# EAGLE design st_ekg_v1 (EAGLE 8.3.1)
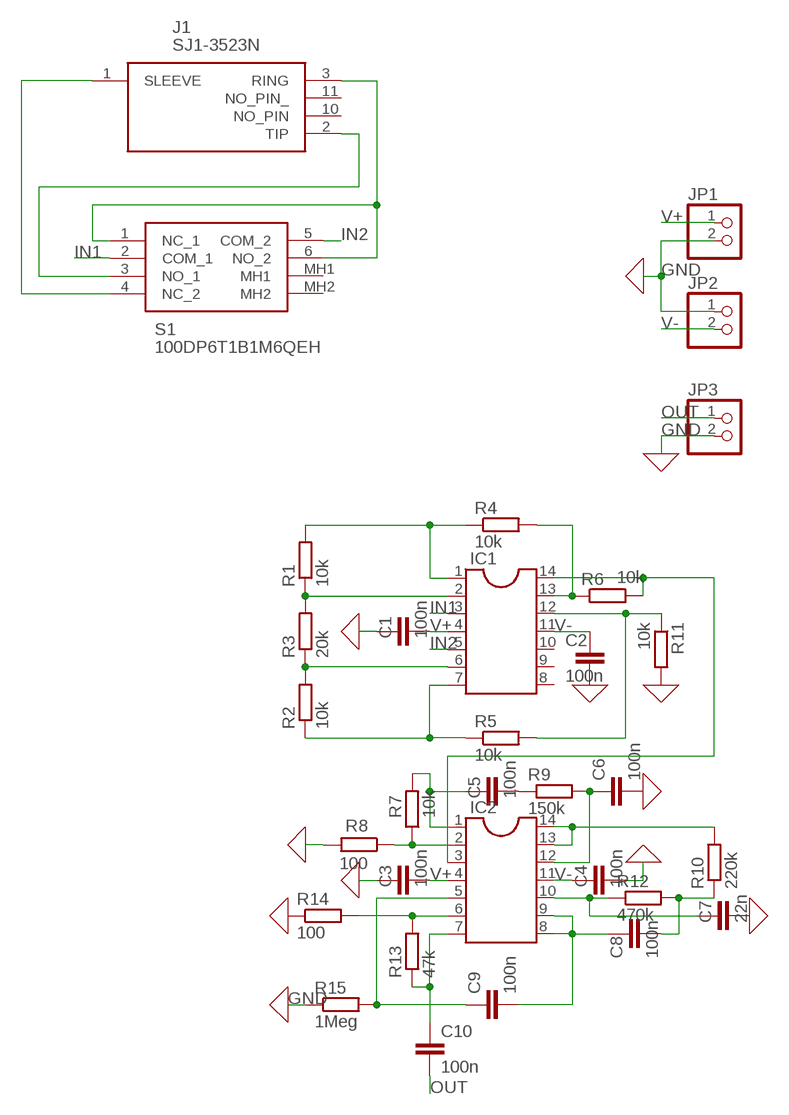
[diagram p0: schematic, sheet 1]

## Parts
C1  100n  C-EUC0805  [C0805]
C2  100n  C-EUC0805  [C0805]
C3  100n  C-EUC0805  [C0805]
C4  100n  C-EUC0805  [C0805]
C5  100n  C-EUC0805  [C0805]
C6  100n  C-EUC0805  [C0805]
C7  22n  C-EUC0805  [C0805]
C8  100n  C-EUC0805  [C0805]
C9  100n  C-EUC0805  [C0805]
C10  100n  C-EUC0805  [C0805]
IC1  DIL14S  [SOCKET-14]
IC2  DIL14S  [SOCKET-14]
J1  SJ1-3523N  [SJ13523N]
JP1  PINHD-1X2  [1X02]
JP2  PINHD-1X2  [1X02]
JP3  PINHD-1X2  [1X02]
R1  10k  R-EU_M0805  [M0805]
R2  10k  R-EU_M0805  [M0805]
R3  20k  R-EU_M0805  [M0805]
R4  10k  R-EU_M0805  [M0805]
R5  10k  R-EU_M0805  [M0805]
R6  10k  R-EU_M0805  [M0805]
R7  10k  R-EU_M0805  [M0805]
R8  100  R-EU_M0805  [M0805]
R9  150k  R-EU_M0805  [M0805]
R10  220k  R-EU_M0805  [M0805]
R11  10k  R-EU_M0805  [M0805]
R12  470k  R-EU_M0805  [M0805]
R13  47k  R-EU_M0805  [M0805]
R14  100  R-EU_M0805  [M0805]
R15  1Meg  R-EU_M0805  [M0805]
S1  100DP6T1B1M6QEH  [100DP6T1B1M6QEH]

## Nets
GND: C1.1 C2.2 C3.1 C4.2 C6.2 C7.2 JP1.2 JP2.1 JP3.2 R8.2 R11.2 R14.1 R15.1
IN1: IC1.3 S1.2(COM_1)
IN2: IC1.5 S1.5(COM_2)
N$1: J1.2(TIP) S1.3(NO_1)
N$2: J1.3(RING) S1.1(NC_1) S1.6(NO_2)
N$3: J1.1(SLEEVE) S1.4(NC_2)
N$4: IC1.2 R1.1 R3.2
N$5: IC1.13 R4.2 R6.1
N$6: IC1.6 R2.2 R3.1
N$7: IC1.12 R5.2 R11.1
N$8: IC1.1 R1.2 R4.1
N$9: IC1.7 R2.1 R5.1
N$10: IC1.14 IC2.3 R6.2
N$12: IC2.2 R7.1 R8.1
N$13: C5.1 IC2.1 R7.2
N$14: C5.2 R9.1
N$15: C6.1 IC2.12 R9.2
N$16: C8.2 R10.1 R12.2
N$17: IC2.13 IC2.14 R10.2
N$18: C7.1 IC2.10 R12.1
N$19: C8.1 C9.2 IC2.8 IC2.9
N$22: C9.1 IC2.5 R15.2
N$23: IC2.6 R13.2 R14.2
N$24: C10.1 IC2.7 R13.1
OUT: C10.2 JP3.1
V+: C1.2 C3.2 IC1.4 IC2.4 JP1.1
V-: C2.1 C4.1 IC1.11 IC2.11 JP2.2
Unconnected: IC1.8 IC1.9 IC1.10 J1.10(NO_PIN) J1.11(NO_PIN_) S1.MH1 S1.MH2

## Library data of the parts
C1-C10 = rcl:C-EU: CAPACITOR, European symbol; SPICEPREFIX: C
IC1 IC2 = ic-package:DIL14: Dual In Line / Socket
J1 = SJ1-3523N:SJ1-3523N: Phone Connectors 3.5 MM AUDIO JACK Source: Datasheet <https://componentsearchengine.com/Datasheets/1/SJ1-3523N.pdf>; DESCRIPTION: Phone Connectors 3.5 MM AUDIO JACK; HEIGHT: 5.5mm; MANUFACTURER_NAME: Same Sky; MANUFACTURER_PART_NUMBER: SJ1-3523N; MOUSER_PART_NUMBER: 490-SJ1-3523N; MOUSER_PRICE-STOCK: https://www.mouser.co.uk/ProductDetail/CUI-Devices/SJ1-3523N?qs=WyjlAZoYn50aNl0vAhb3Tg%3D%3D
JP1-JP3 = pinhead:PINHD-1X2: PIN HEADER
R1-R15 = rcl:R-EU_: RESISTOR, European symbol; SPICEPREFIX: R
S1 = 100DP6T1B1M6QEH:100DP6T1B1M6QEH: TOGGLE, 5A, 120VAC/28VDC DPDT, On-On-On Panel Mount, Right Angle Source: Datasheet <https://configured-product-images.s3.amazonaws.com/2D/specs/100DP6T1B1M6QEH.pdf>; DESCRIPTION: TOGGLE, 5A, 120VAC/28VDC DPDT, On-On-On Panel Mount, Right Angle; HEIGHT: 11.43mm; MANUFACTURER_NAME: E-Switch; MANUFACTURER_PART_NUMBER: 100DP6T1B1M6QEH; MOUSER_PART_NUMBER: 612-100DP6T1B1M6QEH; MOUSER_PRICE-STOCK: https://www.mouser.co.uk/ProductDetail/E-Switch/100DP6T1B1M6QEH?qs=f57gQzlyLiqJaVfqjUPBDA%3D%3D

## Board
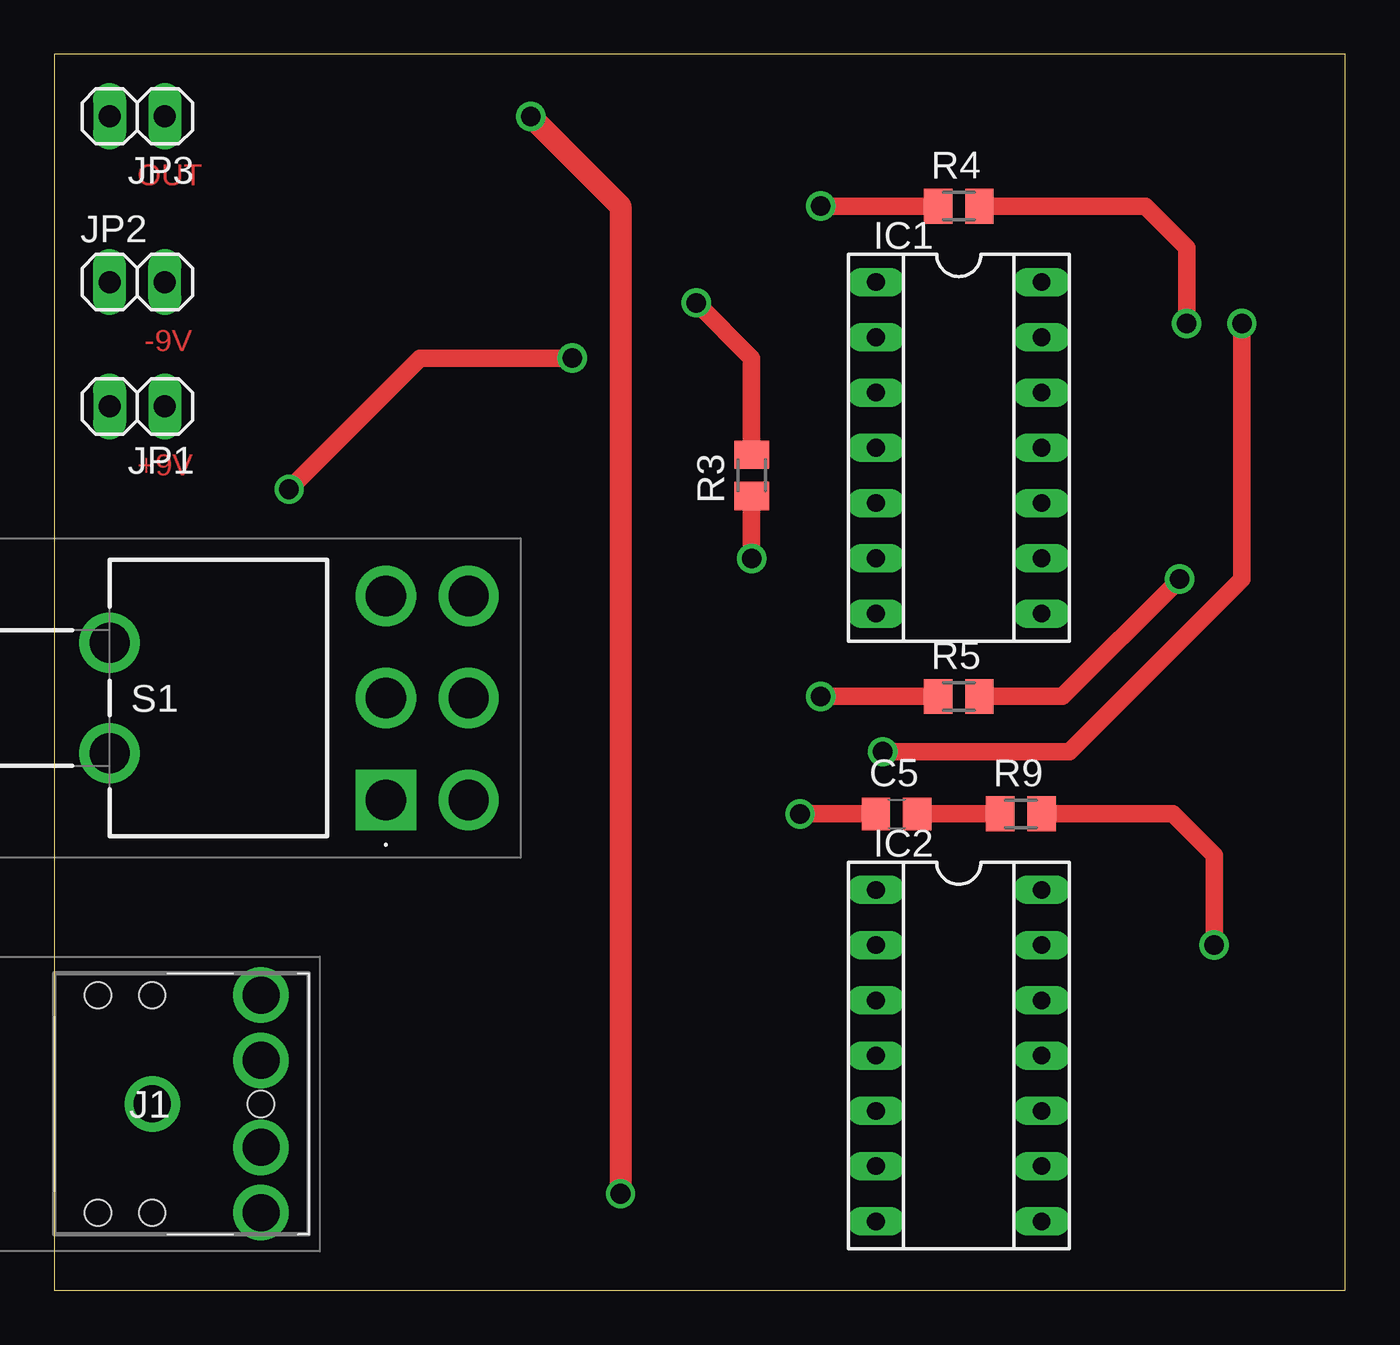
[diagram p1: board, top side]
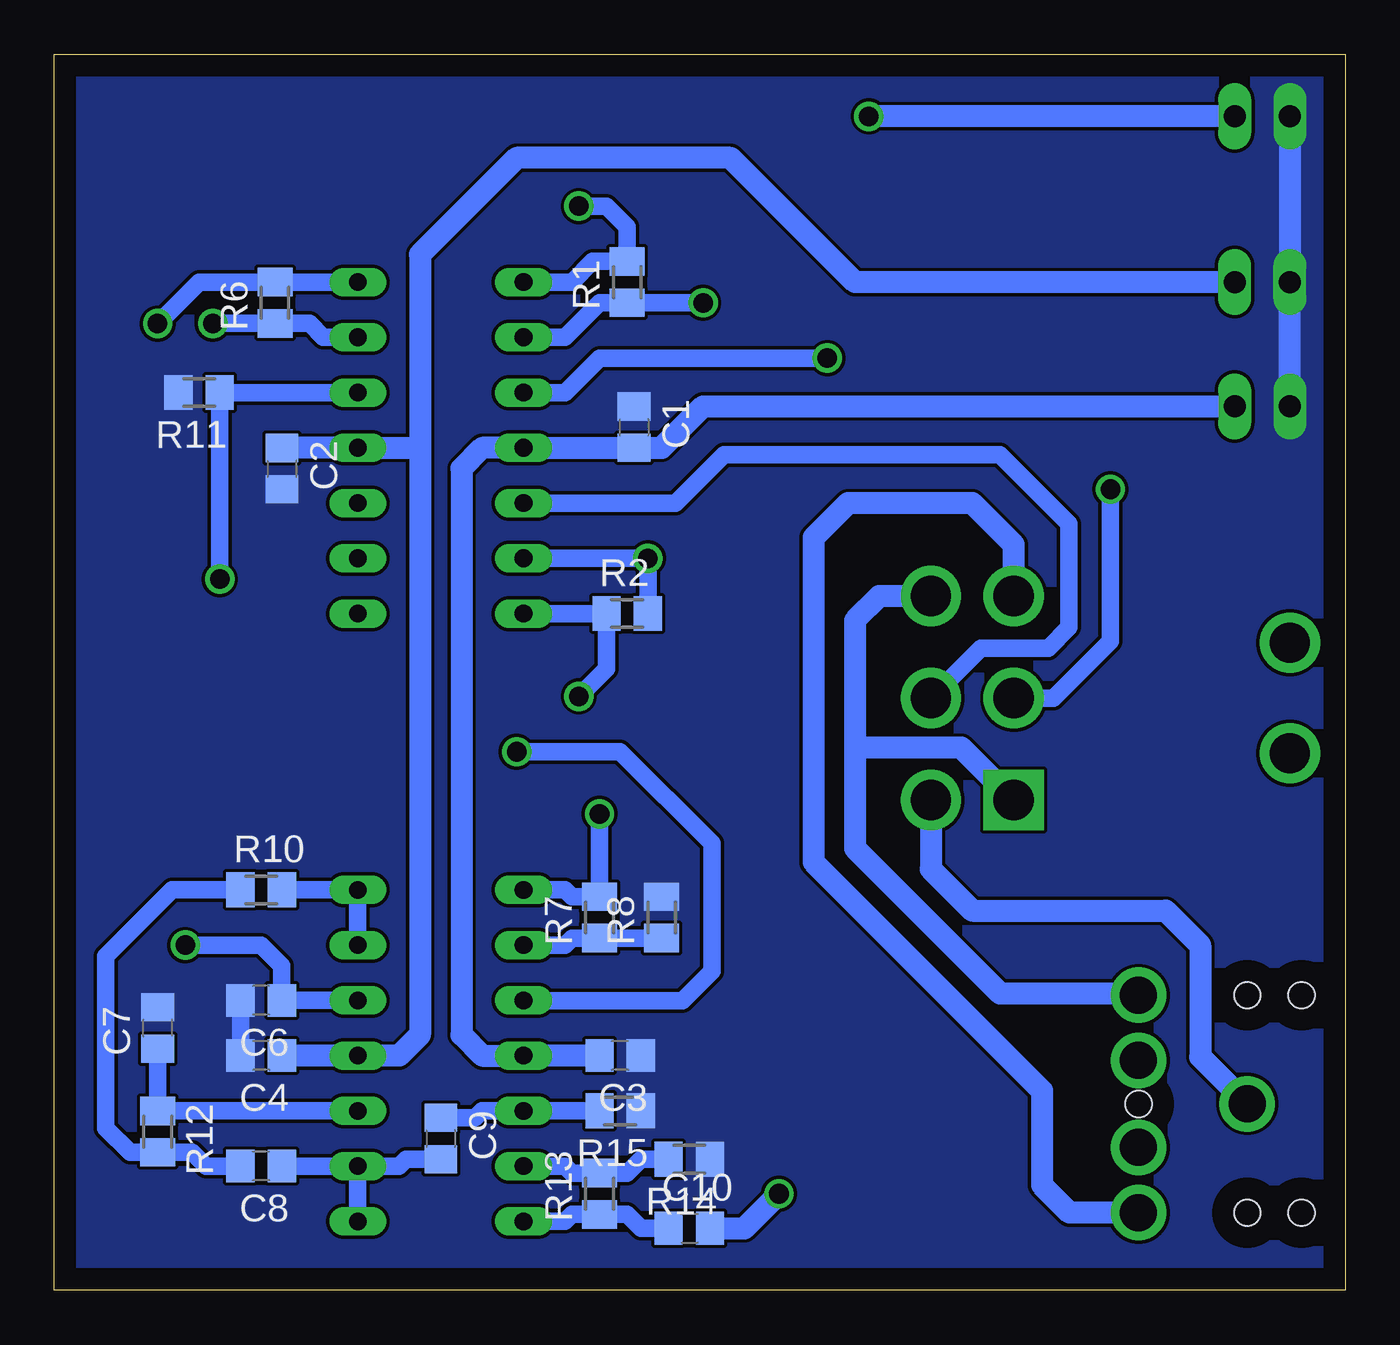
[diagram p2: board, bottom side, seen from below]

Size 59.36 x 56.82 mm. Coordinates in mm from the lower left corner, seen from the top.
Outline: 0,0 59.36,0 59.36,56.82 0,56.82 0,0
Copper layers (1*16): Top 0.035mm / dielectric 1.5mm / Bottom 0.035mm
Design rules "default": minimum track width 6mil, minimum drill 0.35mm, track to track 6mil, track to pad 6mil, pad to pad 6mil, via to via 6mil, smd to smd 6mil, copper to edge 40mil, drill to drill 6mil, minimum pad ring 10mil, minimum via ring 8mil, stop-mask expansion 4mil, vias tented up to drill 0mil, thermal gap 10mil

### Footprints (pad centres in the part's own frame; a part is rotated, then mirrored left to right if it is on the bottom)
C0805 = smd 1.3 x 1.5: 1 -0.95,0; 2 0.95,0
SOCKET-14 = drill 0.813 long: 1 -7.62,-3.81; 2 -5.08,-3.81; 3 -2.54,-3.81; 4 0,-3.81; 5 2.54,-3.81; 6 5.08,-3.81; 7 7.62,-3.81; 8 7.62,3.81; 9 5.08,3.81; 10 2.54,3.81; 11 0,3.81; 12 -2.54,3.81; 13 -5.08,3.81; 14 -7.62,3.81
SJ13523N = drill 1.7 pad 2.55: 1 4.5,0; 2 9.5,-5; 3 9.5,5 | drill 1.7 pad 2.4: 10 9.5,-2; 11 9.5,2 | hole 1.2: 2,5; 4.5,5; 9.5,0; 2,-5; 4.5,-5
1X02 = drill 1.016 long: 1 -1.27,0; 2 1.27,0
M0805 = smd 1.3 x 1.6: 1 -0.95,0; 2 0.95,0
100DP6T1B1M6QEH = drill 1.85 pad 2.775 square: 1 0,0 | drill 1.85 pad 2.775: 2 0,4.69; 3 0,9.38; 4 3.81,0; 5 3.81,4.69; 6 3.81,9.38; MH1 -12.7,2.15; MH2 -12.7,7.23

### Placement (x,y rotation side)
C1  32.7,39.69 270 bottom
C2  48.9,37.78 270 bottom
C3  33.34,10.79 180 bottom
C4  49.85,10.79 180 bottom
C5  38.73,21.91 0 top
C6  49.85,13.34 180 bottom
C7  54.61,12.06 90 bottom
C8  49.85,5.71 180 bottom
C9  41.59,6.99 270 bottom
C10  30.16,2.86 0 bottom
IC1  41.59,38.73 270 top
IC2  41.59,10.79 270 top
J1  0,8.57 0 top
JP1  3.81,40.64 180 top
JP2  3.81,46.35 0 top
JP3  3.81,53.98 180 top
R1  33.02,46.35 90 bottom
R2  33.02,31.11 0 bottom
R3  32.07,37.47 90 top
R4  41.59,49.85 0 top
R5  41.59,27.3 0 top
R6  49.21,45.4 90 bottom
R7  34.29,17.14 90 bottom
R8  31.43,17.14 90 bottom
R9  44.45,21.91 0 top
R10  49.85,18.41 0 bottom
R11  52.7,41.27 180 bottom
R12  54.61,7.3 270 bottom
R13  34.29,4.45 90 bottom
R14  30.16,6.03 180 bottom
R15  33.34,8.26 180 bottom
S1  15.24,22.54 0 top

### Tracks (layer width: path | path; a pad name or v marks a point on that pad's centre or on a via)
GND
  Bottom 0.813: C6.2 C4.2
  Bottom 1.016: JP1.2 JP2.1 JP3.2
  pour Bottom (no thermals): 0,56.83 59.37,56.83 59.37,0 0,0
IN1  (via drill 0.9)
  Top 0.813: v10.79,36.83 16.83,42.86 v23.81,42.86
  Bottom 0.813: S1.2 13.41,27.23 10.79,29.84 v10.79,36.83 | IC1.3 35.88,41.27 34.29,42.86 v23.81,42.86
IN2
  Bottom 0.813: S1.5 16.75,29.53 13.65,29.53 12.7,30.48 12.7,35.24 15.88,38.42 28.57,38.42 30.8,36.2 IC1.5
N$1
  Bottom 1.016: S1.3 15.24,34.29 17.14,36.2 22.86,36.2 24.45,34.61 24.45,19.68 13.95,9.18 13.95,4.84 12.68,3.57 J1.2
N$2
  Bottom 1.016: S1.1 17.65,24.96 22.42,24.96 22.54,25.08 | S1.6 21.42,31.92 22.54,30.8 22.54,25.08 | 22.54,25.08 22.54,20.32 15.88,13.65 9.53,13.65 9.5,13.63 J1.3
N$3
  Bottom 1.016: S1.4 19.05,19.37 17.14,17.46 8.26,17.46 6.67,15.88 6.67,10.74 J1.1
N$4  (via drill 0.9)
  Top 0.813: R3.2 32.07,42.86 v29.53,45.4
  Bottom 0.813: IC1.2 35.88,43.81 34.29,45.41 R1.1 v29.53,45.41 v29.53,45.4
N$5  (via drill 0.9)
  Top 0.813: R4.2 50.16,49.85 52.07,47.94 v52.07,44.45
  Bottom 0.813: IC1.13 46.99,43.81 47.63,44.45 R6.1 v52.07,44.45
N$6  (via drill 0.9)
  Top 0.813: v32.07,33.66 R3.1
  Bottom 0.813: IC1.6 v32.07,33.66 R2.2
N$7  (via drill 0.9)
  Top 0.813: v51.75,32.7 46.35,27.3 R5.2
  Bottom 0.813: IC1.12 R11.1 v51.75,32.7
N$8  (via drill 0.9)
  Top 0.813: v35.24,49.85 R4.1
  Bottom 0.813: IC1.1 35.56,46.35 34.61,47.3 R1.2 33.02,48.89 33.97,49.85 v35.24,49.85
N$9  (via drill 0.9)
  Top 0.813: v35.24,27.3 R5.1
  Bottom 0.813: IC1.7 R2.1 33.97,28.58 v35.24,27.3
N$10  (via drill 0.9)
  Top 0.813: v54.61,44.45 54.61,32.7 46.67,24.77 v38.1,24.77
  Bottom 0.813: v38.1,24.77 33.34,24.77 29.12,20.55 29.12,14.68 30.48,13.32 37.77,13.32 IC2.3 | IC1.14 R6.2 | R6.2 52.71,46.35 v54.61,44.45
  Bottom 1.016: R6.2
N$12
  Bottom 0.813: IC2.2 35.88,15.88 35.56,16.2 R7.1 R8.1
N$13  (via drill 0.9)
  Top 0.813: v34.29,21.91 C5.1
  Bottom 0.813: IC2.1 35.88,18.41 35.56,18.09 R7.2 v34.29,21.91
N$14
  Top 0.813: C5.2 R9.1
N$15  (via drill 0.9)
  Top 0.813: v53.34,15.88 53.34,20 51.44,21.91 R9.2
  Bottom 0.813: IC2.12 C6.1 48.9,14.93 49.85,15.88 v53.34,15.88
N$16
  Bottom 0.813: C8.2 52.39,5.71 53.02,6.35 R12.2 55.88,6.35 56.99,7.46 56.99,15.36 53.94,18.41 R10.1
N$17
  Bottom 0.813: R10.2 IC2.14 IC2.13
N$18
  Bottom 0.813: IC2.10 R12.1 C7.1
N$19
  Bottom 0.813: C9.2 43.18,6.04 43.5,5.71 IC2.9 | IC2.9 C8.1 | IC2.8 IC2.9
N$22
  Bottom 0.813: C9.1 40.01,7.93 39.69,8.26 IC2.5 R15.2
N$23
  Bottom 0.813: IC2.6 35.88,5.71 35.56,5.4 R13.2 33.02,5.39 32.38,6.03 R14.2
N$24
  Bottom 0.813: IC2.7 35.88,3.17 35.56,3.5 R13.1 33.02,3.5 32.38,2.86 C10.1
OUT  (via drill 0.9)
  Top 1.016: v21.91,53.98 26.04,49.85 v26.04,4.45
  Bottom 1.016: v26.04,4.45 27.62,2.86 C10.2 | JP3.1 v21.91,53.98
V+
  Bottom 1.016: C3.2 IC2.4 39.69,10.79 40.64,11.75 40.64,37.78 39.69,38.73 IC1.4 C1.2 31.43,38.74 29.52,40.64 JP1.1
V-
  Bottom 1.016: C2.1 IC1.11 42.55,38.73 | C4.1 IC2.11 43.5,10.79 42.55,11.75 42.55,38.73 | JP2.2 22.54,46.35 28.26,52.07 38.1,52.07 42.55,47.62 42.55,38.73

### Text on the board
Top: OUT | -9V | +9V